# EAGLE design DroidController rev02 (EAGLE 9.4.2)
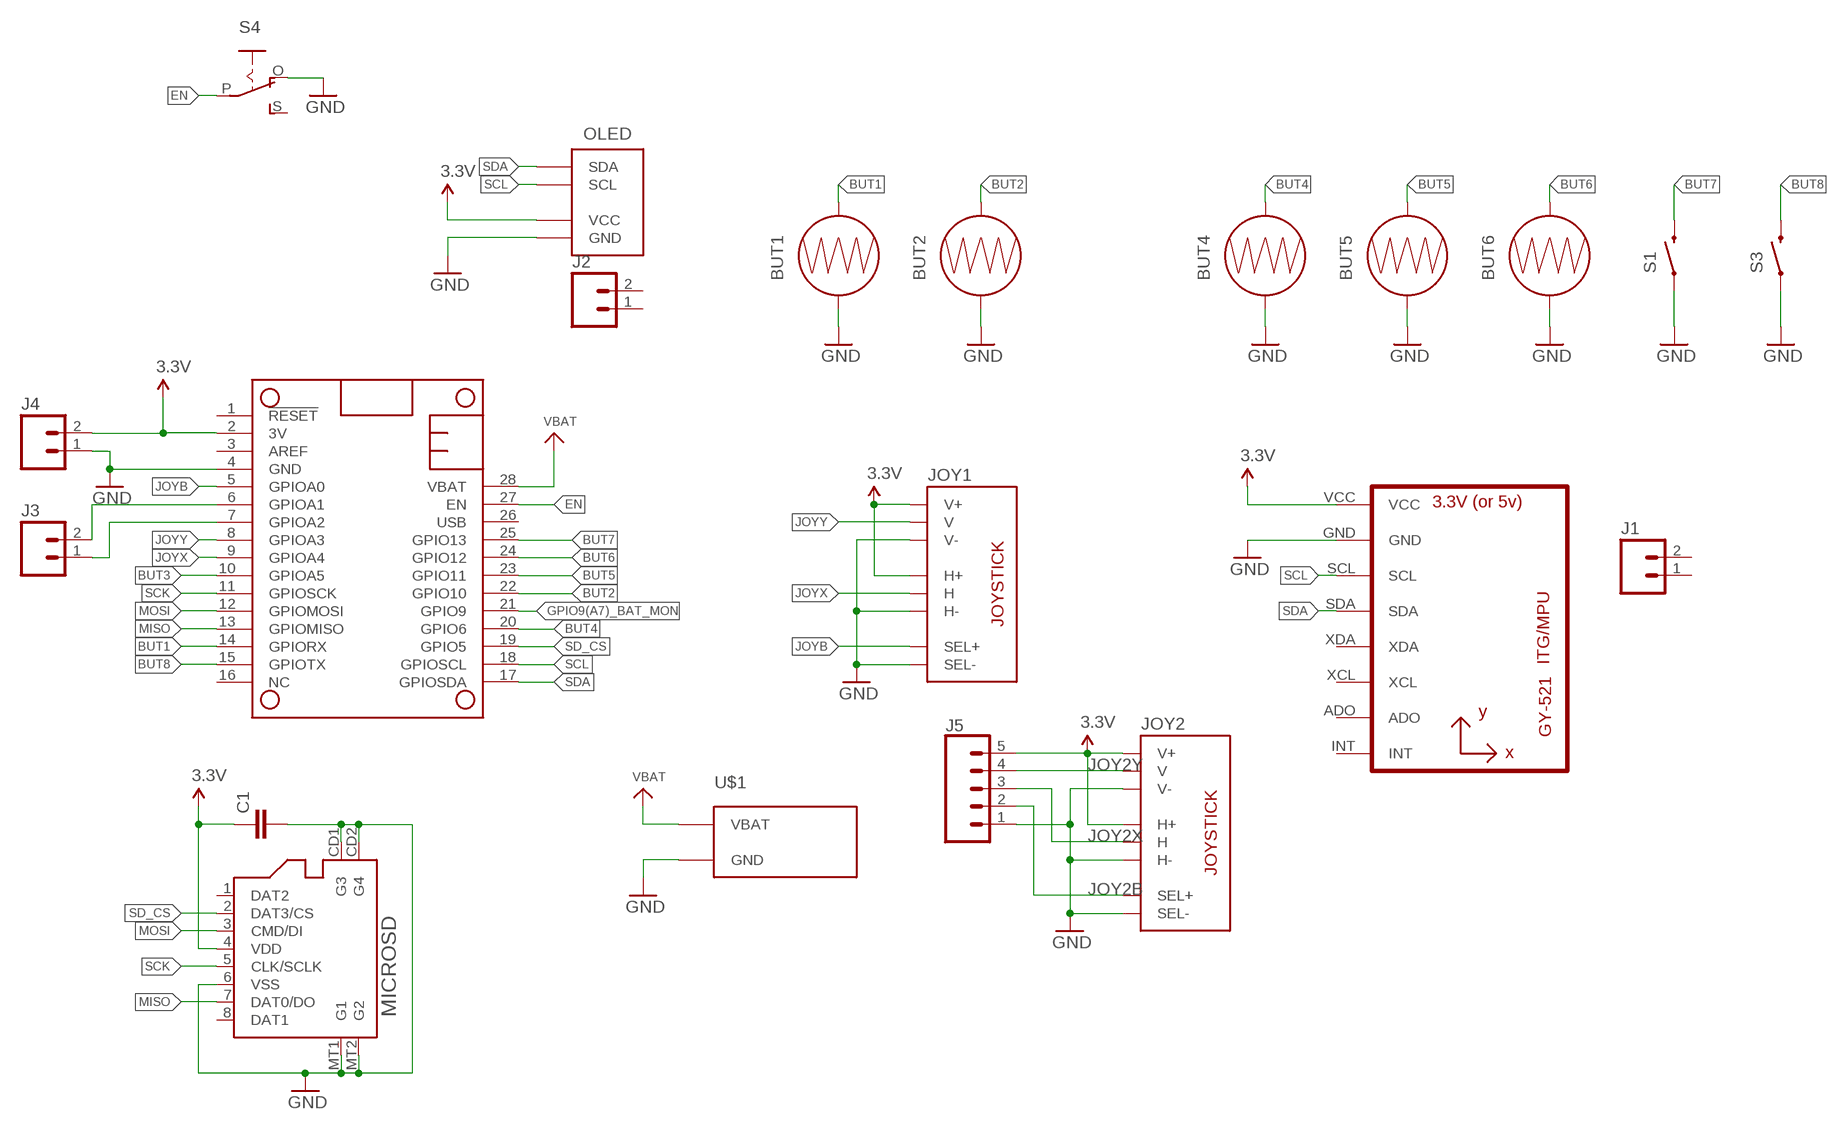
[diagram p0: schematic, sheet 1]

## Parts
BUT1  BUTTON-CONDUCTIVEBUTTON-COND2  [BUTTON-CONDUCTIVE2]
BUT2  BUTTON-CONDUCTIVEBUTTON-COND2  [BUTTON-CONDUCTIVE2]
BUT4  BUTTON-CONDUCTIVEBUTTON-COND2  [BUTTON-CONDUCTIVE2]
BUT5  BUTTON-CONDUCTIVEBUTTON-COND2  [BUTTON-CONDUCTIVE2]
BUT6  BUTTON-CONDUCTIVEBUTTON-COND2  [BUTTON-CONDUCTIVE2]
C1  C-EUC0603  [C0603]
J1  M02PTH  [1X02]
J2  M02PTH  [1X02]
J3  M02PTH  [1X02]
J4  M02PTH  [1X02]
J5  CONN_05  [1X05]
JOY1  JOYSTICK  [JOYSTICK_SM]
JOY2  JOYSTICK  [JOYSTICK_SM]
MICROSD  MICROSD  [MICROSD_SMALL]
MS1  FEATHERWING_NODIM  [FEATHERWING_DIM]
OLED  SH1106_I2C  [SH1106_128X32]
S1  SWITCH-MOMENTARY-2SIDE_EZ  [TACTILE-PTH-SIDEEZ]
S3  SWITCH-MOMENTARY-2SIDE_EZ  [TACTILE-PTH-SIDEEZ]
S4  EG1218S  [EG1218]
U2  GY-521MPU6050  [GY-521]
U$1  KEYSTONE_BAT  [1042]

## Nets
3.3V [medpwr]: C1.1 J4.2 J5.5 JOY1.H1(H+) JOY1.V1(V+) JOY2.H1(H+) JOY2.V1(V+) MICROSD.4(VDD) MS1.2(3V) OLED.VCC U2.VCC
BUT1: BUT1.2 MS1.14(GPIORX)
BUT2: BUT2.2 MS1.22(GPIO10)
BUT3: MS1.10(GPIOA5)
BUT4: BUT4.2 MS1.20(GPIO6)
BUT5: BUT5.2 MS1.23(GPIO11)
BUT6: BUT6.2 MS1.24(GPIO12)
BUT7: MS1.25(GPIO13) S1.2
BUT8: MS1.15(GPIOTX) S3.2
EN: MS1.27(EN) S4.P
GND: BUT1.1 BUT2.1 BUT4.1 BUT5.1 BUT6.1 C1.2 J4.1 J5.1 JOY1.B2A(SEL-) JOY1.H3(H-) JOY1.V3(V-) JOY2.B2A(SEL-) JOY2.H3(H-) JOY2.V3(V-) MICROSD.6(VSS) MICROSD.CD1(G3) MICROSD.CD2(G4) MICROSD.MT1(G1) MICROSD.MT2(G2) MS1.4(GND) OLED.GND S1.1 S3.1 S4.O U2.GND U$1.GND
GPIO9(A7)_BAT_MON: MS1.21(GPIO9)
JOY2B: J5.2 JOY2.B1A(SEL+)
JOY2X: J5.3 JOY2.H2(H)
JOY2Y: J5.4 JOY2.V2(V)
JOYB: JOY1.B1A(SEL+) MS1.5(GPIOA0)
JOYX: JOY1.H2(H) MS1.9(GPIOA4)
JOYY: JOY1.V2(V) MS1.8(GPIOA3)
MISO: MICROSD.7(DAT0/DO) MS1.13(GPIOMISO)
MOSI: MICROSD.3(CMD/DI) MS1.12(GPIOMOSI)
N$1: J3.2 MS1.6(GPIOA1)
N$2: J3.1 MS1.7(GPIOA2)
SCK: MICROSD.5(CLK/SCLK) MS1.11(GPIOSCK)
SCL: MS1.18(GPIOSCL) OLED.SCL U2.SCL
SD_CS: MICROSD.2(DAT3/CS) MS1.19(GPIO5)
SDA: MS1.17(GPIOSDA) OLED.SDA U2.SDA
VBAT [bigpwr]: MS1.28(VBAT) U$1.VBAT
Unconnected: J1.1 J1.2 J2.1 J2.2 MICROSD.1(DAT2) MICROSD.8(DAT1) MS1.1(!RESET) MS1.3(AREF) MS1.16(NC) MS1.26(USB) S4.S U2.ADO U2.INT U2.XCL U2.XDA

## Library data of the parts
BUT1 BUT2 BUT4-BUT6 = rseries:BUTTON-CONDUCTIVE: Used with rubber key pads. This one was designed and proven to work with the PolyCase Key FOB enclosures.
C1 = rcl:C-EU: CAPACITOR, European symbol; SPICEPREFIX: C
J1-J4 = SparkFun-Connectors:M02: Standard 2-pin 0.1" header. Use with - straight break away headers ( PRT-00116) - right angle break away headers (PRT-00553) - swiss pins (PRT-00743) - machine pins (PRT-00117) - female headers (PRT-00115) Molex polarized connector foot print use with: PRT-08233 with associated crimp pins and housings. 2.54_SCREWTERM for use with PRT-10571. 3.5mm Screw Terminal footprints for PRT-08084 5mm Screw Terminal footprints for use with PRT-08432
J5 = SparkFun-Connectors:CONN_05: Multi connection point. Often used as Generic Header-pin footprint for 0.1 inch spaced/style header connections On any of the 0.1 inch spaced packages, you can populate with these: Break Away Headers - Straight <https://www.sparkfun.com/products/116> (PRT-00116) Break Away Male Headers - Right Angle <https://www.sparkfun.com/products/553> (PRT-00553) Female Headers <https://www.sparkfun.com/products/115> (PRT-00115) Break Away Headers - Machine Pin <https://www.sparkfun.com/products/117> (PRT-00117) Break Away Female Headers - Swiss Machine Pin <https://www.sparkfun.com/products/743> (PRT-00743) For SCREWTERMINALS and SPRING TERMINALS visit here: Screw Terimnals on SparkFun.com <https://www.sparkfun.com/search/results?term=Screw+Terminals> (5mm/3.5mm/2.54mm spacing) This device is also useful as a general connection point to wire up your design to another part of your project. Our various solder wires solder well into these plated through hole pads. Hook-Up Wire - Assortment (Stranded, 22 AWG) <https://www.sparkfun.com/products/11375> (PRT-11375) Hook-Up Wire - Assortment (Solid Core, 22 AWG) <https://www.sparkfun.com/products/11367> (PRT-11367) View the entire wire category on our website here <https://www.sparkfun.com/categories/141> Special notes: Molex polarized connector foot print use with SKU : PRT-08231 with associated crimp pins and housings. 1MM SMD Version SKU: PRT-10208
JOY1 JOY2 = rseries:JOYSTICK: Thumb Joystick Joystick commonly found in PS2 controllers. Two pots and a select switch. Adapted from Sparkfun Library (but for more common 6mm switch sticks)
MICROSD = rseries:MICROSD: Micro-SD / Transflash card holder with SPI pinout For the Molex 0473093751 small-footprint MicroSD holder.
MS1 = rseries:FEATHERWING
OLED = rseries:SH1106_I2C
S1 S3 = SparkFun-Electromechanical:SWITCH-MOMENTARY-2: Various NO switches- pushbuttons, reed, etc
S4 = adafruit:EG1218: SLIDING SWITCH 0.1" spacing through hole, vertical SPDT slide switch http://www.ladyada.net/library/pcb/eaglelibrary.html
U2 = rseries:GY-521
U$1 = rseries:KEYSTONE_BAT

## Net classes
0 default: width 0.305 mm, drill 0.254 mm, clearance 0.254 mm
1 bigpwr: width 0.762 mm, drill 0.254 mm, clearance 0.254 mm
2 medpwr: width 0.61 mm, drill 0.254 mm, clearance 0.203 mm

## Board
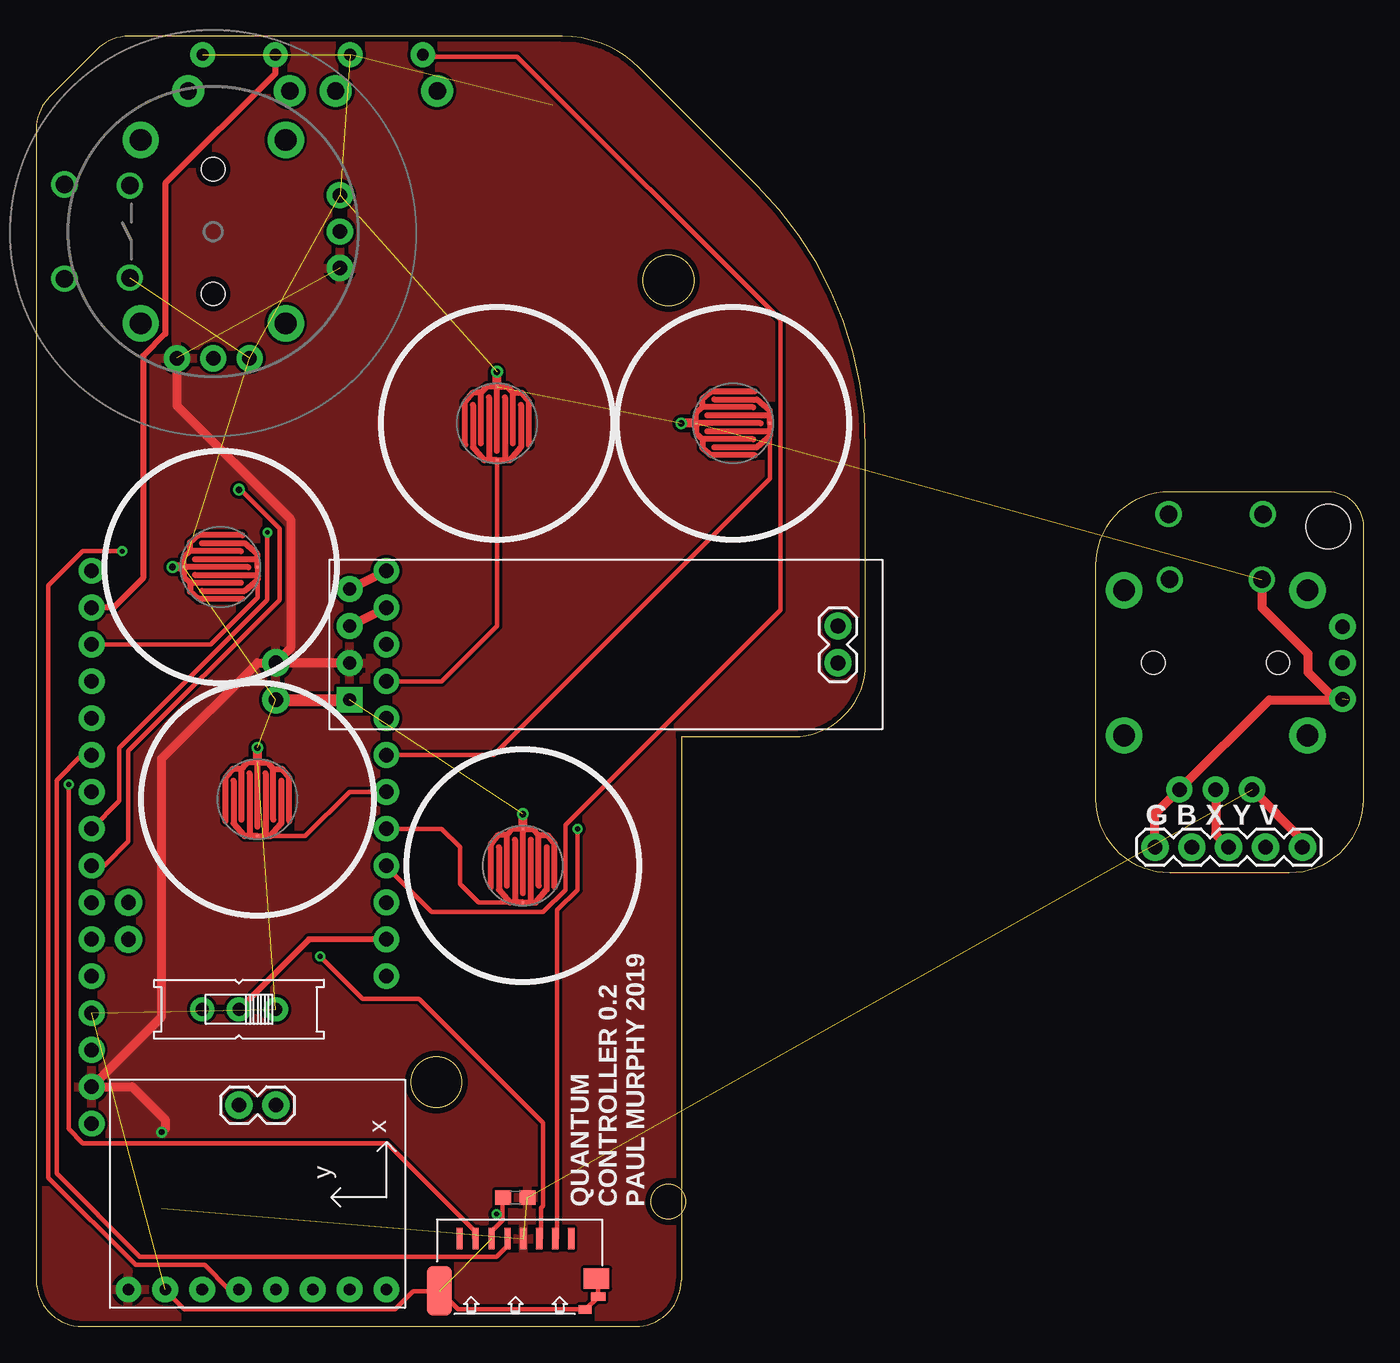
[diagram p1: board, top side]
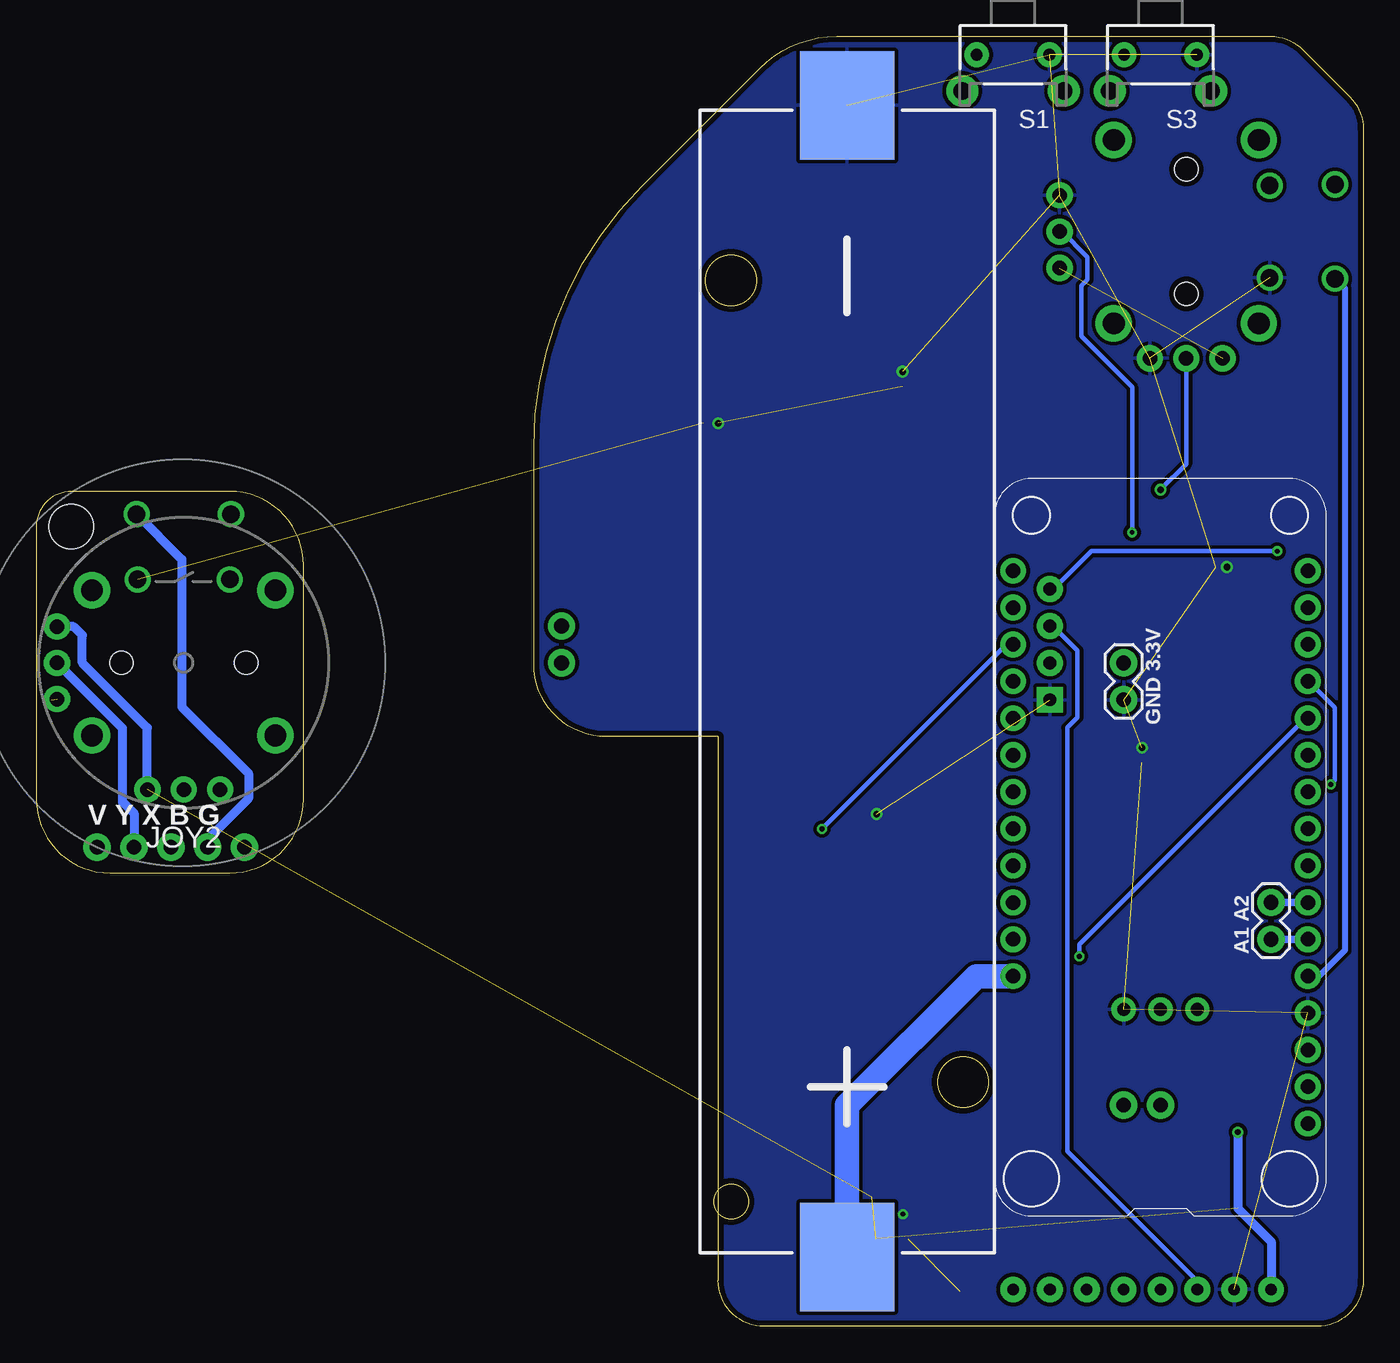
[diagram p2: board, bottom side, seen from below]

Size 91.44 x 88.9 mm. Coordinates in mm from the lower left corner, seen from the top.
Outline: 4.15,87.97 0.93,84.75 arc45 0,82.5 0,3.17 arc90 3.17,0 41.27,0 arc90 44.45,3.17 44.45,40.64 52.15,40.64 arc90 57.15,45.64 57.15,60.6 arc45 49.71,78.56 41.57,86.7 arc45 36.26,88.9 6.35,88.9 arc45 4.15,87.97
Outline: 78.11,57.53 89.03,57.53 arc-90 91.44,55.12 91.44,36.32 arc-90 86.36,31.24 78.11,31.24 arc-90 73.03,36.32 73.03,52.45 arc-90 78.11,57.53
Copper layers (1*16): Top 0.0356mm / dielectric 1.5011mm / Bottom 0.0356mm
Design rules "LaenPCBOrder *": minimum track width 8mil, minimum drill 13mil, track to track 8mil, track to pad 8mil, pad to pad 6mil, via to via 6mil, smd to smd 6mil, copper to edge 15mil, drill to drill 6mil, minimum pad ring 7mil, minimum via ring 7mil, stop-mask expansion 3mil, vias tented up to drill 0mil, thermal gap 10mil
Holes 3.05 mm at 89.03,55.12

### Footprints (pad centres in the part's own frame; a part is rotated, then mirrored left to right if it is on the bottom)
BUTTON-CONDUCTIVE2 = smd 0.203 x 0.203: 1 0,2.54; 2 0,-2.54
C0603 = smd 1.1 x 1: 1 -0.85,0; 2 0.85,0
1X02 = drill 1.016 pad 1.88: 1 0,0; 2 2.54,0
1X05 = drill 1.016 pad 1.88: 1 0,0; 2 2.54,0; 3 5.08,0; 4 7.62,0; 5 10.16,0
JOYSTICK_SM = drill 1.2 pad 1.75: B1A 3.25,-10.25; B1B -3.25,-10.25; B2A 3.175,-5.75; B2B -3.175,-5.75 | drill 1 pad 1.8: H1 2.5,8.73; H2 0,8.73; H3 -2.5,8.73; V1 8.73,-2.5; V2 8.73,0; V3 8.73,2.5 | drill 1.5 pad 2.5: MOUNT1 -6.325,5; MOUNT2 -6.325,-5; MOUNT3 6.325,-5; MOUNT4 6.325,5 | hole 1.6: -4.3,0; 4.3,0
MICROSD_SMALL = smd 0.432 x 1.473: 1 3.85,-0.3; 2 2.75,-0.3; 3 1.65,-0.3; 4 0.55,-0.3; 5 -0.55,-0.3; 6 -1.65,-0.3; 7 -2.75,-0.3; 8 -3.85,-0.3 | smd 0.9 x 0.6: CD1 4.8,-5.2 | smd 1 x 0.6: CD2 5.7,-4.3 | smd 1.7 x 3.4: MT1 -5.25,-3.9 | smd 1.75 x 1.4: MT2 5.575,-3.05
FEATHERWING_DIM = drill 1 pad 1.778: 1 6.35,1.27; 2 8.89,1.27; 3 11.43,1.27; 4 13.97,1.27; 5 16.51,1.27; 6 19.05,1.27; 7 21.59,1.27; 8 24.13,1.27; 9 26.67,1.27; 10 29.21,1.27; 11 31.75,1.27; 12 34.29,1.27; 13 36.83,1.27; 14 39.37,1.27; 15 41.91,1.27; 16 44.45,1.27; 17 44.45,21.59; 18 41.91,21.59; 19 39.37,21.59; 20 36.83,21.59; 21 34.29,21.59; 22 31.75,21.59; 23 29.21,21.59; 24 26.67,21.59; 25 24.13,21.59; 26 21.59,21.59; 27 19.05,21.59; 28 16.51,21.59
SH1106_128X32 = drill 0.889 pad 1.778 square: GND 0,-3.81 | drill 0.889 pad 1.778: SCL 0,1.27; SDA 0,3.81; VCC 0,-1.27
TACTILE-PTH-SIDEEZ = drill 0.8 pad 1.7: 1 -2.5,0; 2 2.5,0 | drill 1.2 pad 2.2: ANCHOR1 -3.5,2.5; ANCHOR2 3.5,2.5
EG1218 = drill 0.9 pad 1.676: O -2.54,0; P 0,0; S 2.54,0
GY-521 = drill 0.8 pad 1.778: ADO -8.89,-6.35; GND -8.89,6.35; INT -8.89,-8.89; SCL -8.89,3.81; SDA -8.89,1.27; VCC -8.89,8.89; XCL -8.89,-3.81; XDA -8.89,-1.27
1042 = smd 7.468 x 6.477: GND -39.688,0; VBAT 39.688,0

### Placement (x,y rotation side)
BUT1  12.7,52.32 90 top
BUT2  48.01,62.23 90 top
BUT4  31.75,62.23 0 top
BUT5  15.24,36.32 0 top
BUT6  33.53,31.75 0 top
C1  33.02,8.89 180 top
J1  13.97,15.24 0 top
J2  55.24,45.72 90 top
J3  6.35,29.21 270 bottom
J4  16.51,43.18 90 bottom
J5  77.09,33.02 0 top
JOY1  12.19,75.44 270 top
JOY2  81.28,45.72 180 bottom
MICROSD  33.02,6.35 0 top
MS1  2.54,7.62 90 bottom
OLED  21.59,46.99 0 top
S1  24.13,87.63 180 bottom
S3  13.97,87.63 180 bottom
S4  13.97,21.84 180 top
U2  15.24,11.43 90 top
U$1  35.56,44.45 270 bottom

### Tracks (layer width: path | path; a pad name or v marks a point on that pad's centre or on a via)
3.3V  (via drill 0.4)  (4 unrouted)
  Top 0.61: JOY1.V1 9.69,63.46 17.53,55.63 17.53,46.74 J4.2 | v8.64,13.38 8.89,13.64 8.89,14.22 6.6,16.51 MS1.2 8.64,21.34 8.64,39.12 15.24,45.72 J4.2 | OLED.VCC J4.2 | JOY2.H1 87.25,33.52 J5.5
  Bottom 0.61: v8.64,13.38 8.64,8.13 6.35,5.84 U2.VCC | JOY2.H1 83.78,41.23 88.27,45.72 88.27,47.62 88.86,48.22 JOY2.V1
  pour Top: -10.16,98.04 68.58,98.04 68.58,-4.57 -10.16,-4.57
BUT1
  Top 0.305: MS1.14 12.01,46.99 15.24,50.22 BUT1.2
BUT2
  Top 0.305: BUT2.2 50.55,58.42 31.5,39.37 MS1.22
BUT4
  Top 0.305: MS1.20 27.94,44.45 31.75,48.26 BUT4.2
BUT5
  Top 0.305: BUT5.2 18.54,33.78 21.59,36.83 MS1.23
BUT6
  Top 0.305: MS1.24 27.94,34.29 29.21,33.02 29.21,30.48 30.48,29.21 BUT6.2
BUT7
  Top 0.305: S1.2 26.68,87.5 33.15,87.5 51.27,69.38 51.27,49.37 36.46,34.56 36.46,30.09 34.92,28.55 27.24,28.55 24.17,31.62 MS1.25
BUT8
  Top 0.406: S3.2 16.47,86.33 8.9,78.76 8.9,68.41 7.37,66.87 7.37,51.56 5.33,49.53 MS1.15
EN
  Top 0.406: S4.P 18.8,26.67 MS1.27
GND  (via drill 0.33, 0.45)  (17 unrouted)
  Top 0.305: MICROSD.MT2 38.7,3.26 38.7,2.15 MICROSD.CD2 38.7,2.01 37.86,1.17 MICROSD.CD1 37.72,1.17 29.06,1.17 27.8,2.43 MICROSD.MT1 27.66,2.43 25.98,2.43 24.73,1.17 10.2,1.17 8.94,2.43 U2.GND | 45.4,62.22 BUT2.1 | 32.13,7.73 32.13,7.31 31.43,6.62 31.43,6.06 MICROSD.6 | 32.13,7.73 32.13,8.85 C1.2 31.99,8.85 | v31.71,7.73 32.13,7.73
  Top 0.61: BUT2.1 v44.45,62.23 | BUT4.1 v31.75,65.79 | BUT5.1 v15.24,39.88 | BUT6.1 v33.53,35.31 | BUT1.1 v9.4,52.32 | JOY2.B2A 84.45,49.53 87.63,46.35 87.63,45.09 89.5,43.22 JOY2.V3 | 90.42,43.18 84.97,43.18 JOY2.H3 77.09,35.3 J5.1
  Top 0.813: J4.1 OLED.GND
  pour Bottom: -5.08,95.25 45.72,95.25 63.5,77.47 63.5,5.08 44.45,-13.97 -15.24,-13.97 -21.59,-7.62 -21.59,78.74
JOY2B
  Bottom 0.61: JOY2.B1A 81.41,52.85 81.41,42.7 76.81,38.1 76.81,36.39 79.63,33.57 J5.2
JOY2X
  Top 0.61: JOY2.H2 81.28,33.91 J5.3
JOY2Y
  Bottom 0.61: J5.4 84.71,35.35 85.49,36.13 85.49,41.2 JOY2.V2
JOYB
  Bottom 0.406: JOY1.B1A 1.27,71.52 1.27,25.91 3.05,24.13 MS1.5
JOYX  (via drill 0.33)
  Top 0.305: v15.93,54.71 15.93,50.06 5.73,39.87 5.73,36.21 MS1.9
  Bottom 0.305: v15.93,54.71 15.93,64.73 19.42,68.22 19.42,71.72 19,72.14 19,73.67 20.82,75.49 JOY1.H2
JOYY  (via drill 0.45)
  Top 0.305: v13.97,57.66 14.1,57.66 16.76,54.99 16.76,50.06 6.35,39.65 6.35,33.4 4.7,31.75 MS1.8
  Bottom 0.305: 12.15,66.41 12.15,66.69 JOY1.V2 12.19,59.44 v13.97,57.66
MISO  (via drill 0.33)
  Top 0.305: v2.23,37.35 2.23,13.6 3.21,12.62 24.17,12.62 30.18,6.62 30.18,6.06 MICROSD.7
  Bottom 0.305: v2.23,37.35 1.96,37.63 1.96,42.66 3.77,44.48 MS1.13
MOSI  (via drill 0.33)
  Top 0.305: v19.56,25.5 22.49,22.57 26.39,22.57 34.92,14.03 34.92,8.29 34.78,8.15 34.78,6.06 MICROSD.3
  Bottom 0.305: v19.56,25.5 19.56,26.31 3.91,41.96 MS1.12
N$1
  Bottom 0.508: MS1.6 J3.2
N$2
  Bottom 0.508: MS1.7 J3.1
SCK
  Top 0.305: MICROSD.5 32.41,5.92 32.41,5.5 31.71,4.8 7.12,4.8 1.4,10.53 1.4,37.63 3.07,39.31 3.77,39.31 MS1.11
SCL
  Top 0.61: OLED.SCL MS1.18
  Bottom 0.305: U2.SCL 11.46,2.56 11.46,3.12 20.4,12.06 20.4,41.26 19.7,41.96 19.7,46.57 21.51,48.39 OLED.SCL
SD_CS  (via drill 0.33)
  Top 0.305: v37.3,34.28 37.3,30.09 35.9,28.69 35.9,6.06 MICROSD.2
  Bottom 0.305: v37.3,34.28 24.59,46.99 MS1.19
SDA  (via drill 0.33)
  Top 0.305: v5.93,53.42 3.21,53.42 0.84,51.04 0.84,10.25 6.84,4.24 11.6,4.24 13.27,2.56 13.97,2.56 U2.SDA
  Top 0.61: OLED.SDA MS1.17
  Bottom 0.305: v5.93,53.42 18.72,53.42 21.23,50.9 21.51,50.9 OLED.SDA
VBAT
  Bottom 1.676: U$1.VBAT 35.56,15.24 26.67,24.13 MS1.28

### Text on the board
tPlace: G B X Y V | QUANTUM / CONTROLLER 0.2 / PAUL MURPHY 2019
bPlace: GND 3.3V | V Y X B G | A1 A2